# EAGLE schematic spi_lcd_dip_v1 (EAGLE 6.1)
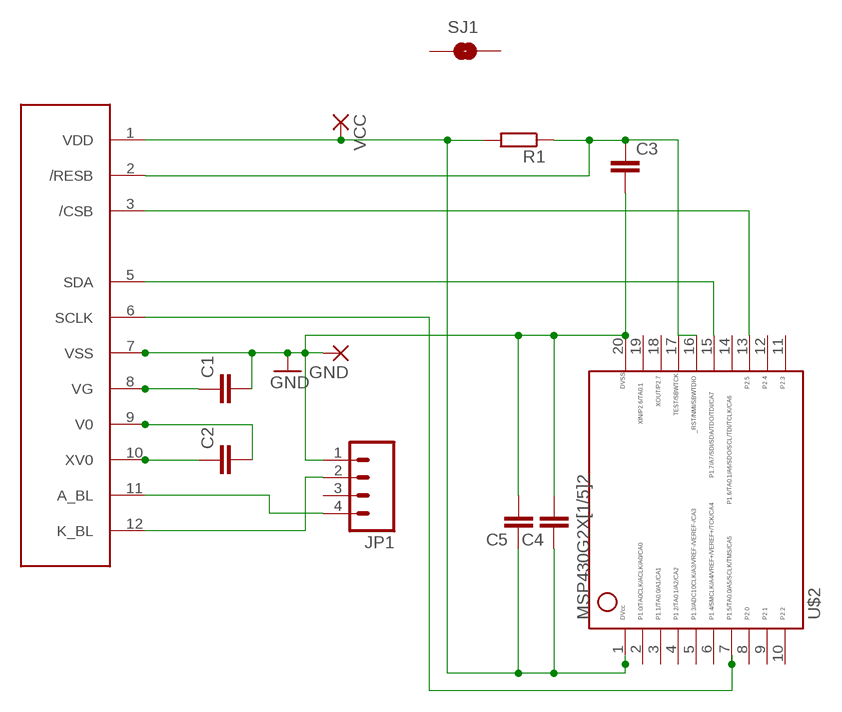
[diagram p0: schematic, sheet 1]

## Parts
C1  CAP1206  [1206]
C2  CAP1206  [1206]
C3  CAP1206  [1206]
C4  CAP1206  [1206]
C5  CAP1206  [1206]
GND  2,15/1,0  [2,15/1,0]
JP1  M04PTH  [1X04]
R1  R-EU_R1206  [R1206]
SJ1  SOLDERJUMPERTRACE  [SJ_2S-TRACE]
U$1  PE9665WRFPE9665WRF-WHOLE  [PE9665WRF]
U$2  G2X[1/5]2---N20  [N20]
VCC  2,15/1,0  [2,15/1,0]

## Nets
GND: C1.2 C3.2 C4.2 C5.2 GND.1(P) JP1.1 U$1.7(VSS) U$2.20
N$1: C2.1 U$1.10(XV0)
N$2: C2.2 U$1.9(V0)
N$3: C1.1 U$1.8(VG)
N$5: C3.1 R1.1 U$1.2(/RESB) U$2.16
N$6: C4.1 C5.1 R1.2 U$1.1(VDD) U$2.1 VCC.1(P)
N$8: U$1.5(SDA) U$2.15
N$9: U$1.3(/CSB) U$2.13
N$10: U$1.6(SCLK) U$2.7
N$23: JP1.2 U$1.12(K_BL)
N$24: JP1.4 U$1.11(A_BL)
Unconnected: JP1.3 SJ1.1 SJ1.2 U$2.2 U$2.3 U$2.4 U$2.5 U$2.6 U$2.8 U$2.9 U$2.10 U$2.11 U$2.12 U$2.14 U$2.17 U$2.18 U$2.19

## Library data of the parts
C1-C5 = SparkFun:CAP: Capacitor Standard 0603 ceramic capacitor, and 0.1" leaded capacitor.
GND VCC = wirepad:2,15/1,0: THROUGH-HOLE PAD
JP1 = SparkFun-Connectors:M04: Header 4 Standard 4-pin 0.1" header. Use with straight break away headers (SKU : PRT-00116), right angle break away headers (PRT-00553), swiss pins (PRT-00743), machine pins (PRT-00117), and female headers (PRT-00115). Molex polarized connector foot print use with SKU : PRT-08231 with associated crimp pins and housings. 1MM SMD Version SKU: PRT-10208
R1 = resistor:R-EU_: RESISTOR, European symbol
SJ1 = SparkFun-Passives:SOLDERJUMPER: Solder Jumper Standard SMD solder jumper. Used to automate production. Two varients : Normally Open and Normally Closed are the same, but have different paste layers. NC will have a large amount of paste and should jumper during reflow.
U$1 = apus-spidisplay:PE9665WRF
U$2 = TI_MSP430_v16:G2X[1/5]2---N20: MSP430G2X[1/5]2 MSP430G2x52, MSP430G2x12 PDIP (N) 20 Pin Package http://focus.ti.com/docs/prod/folders/print/msp430g2452.html